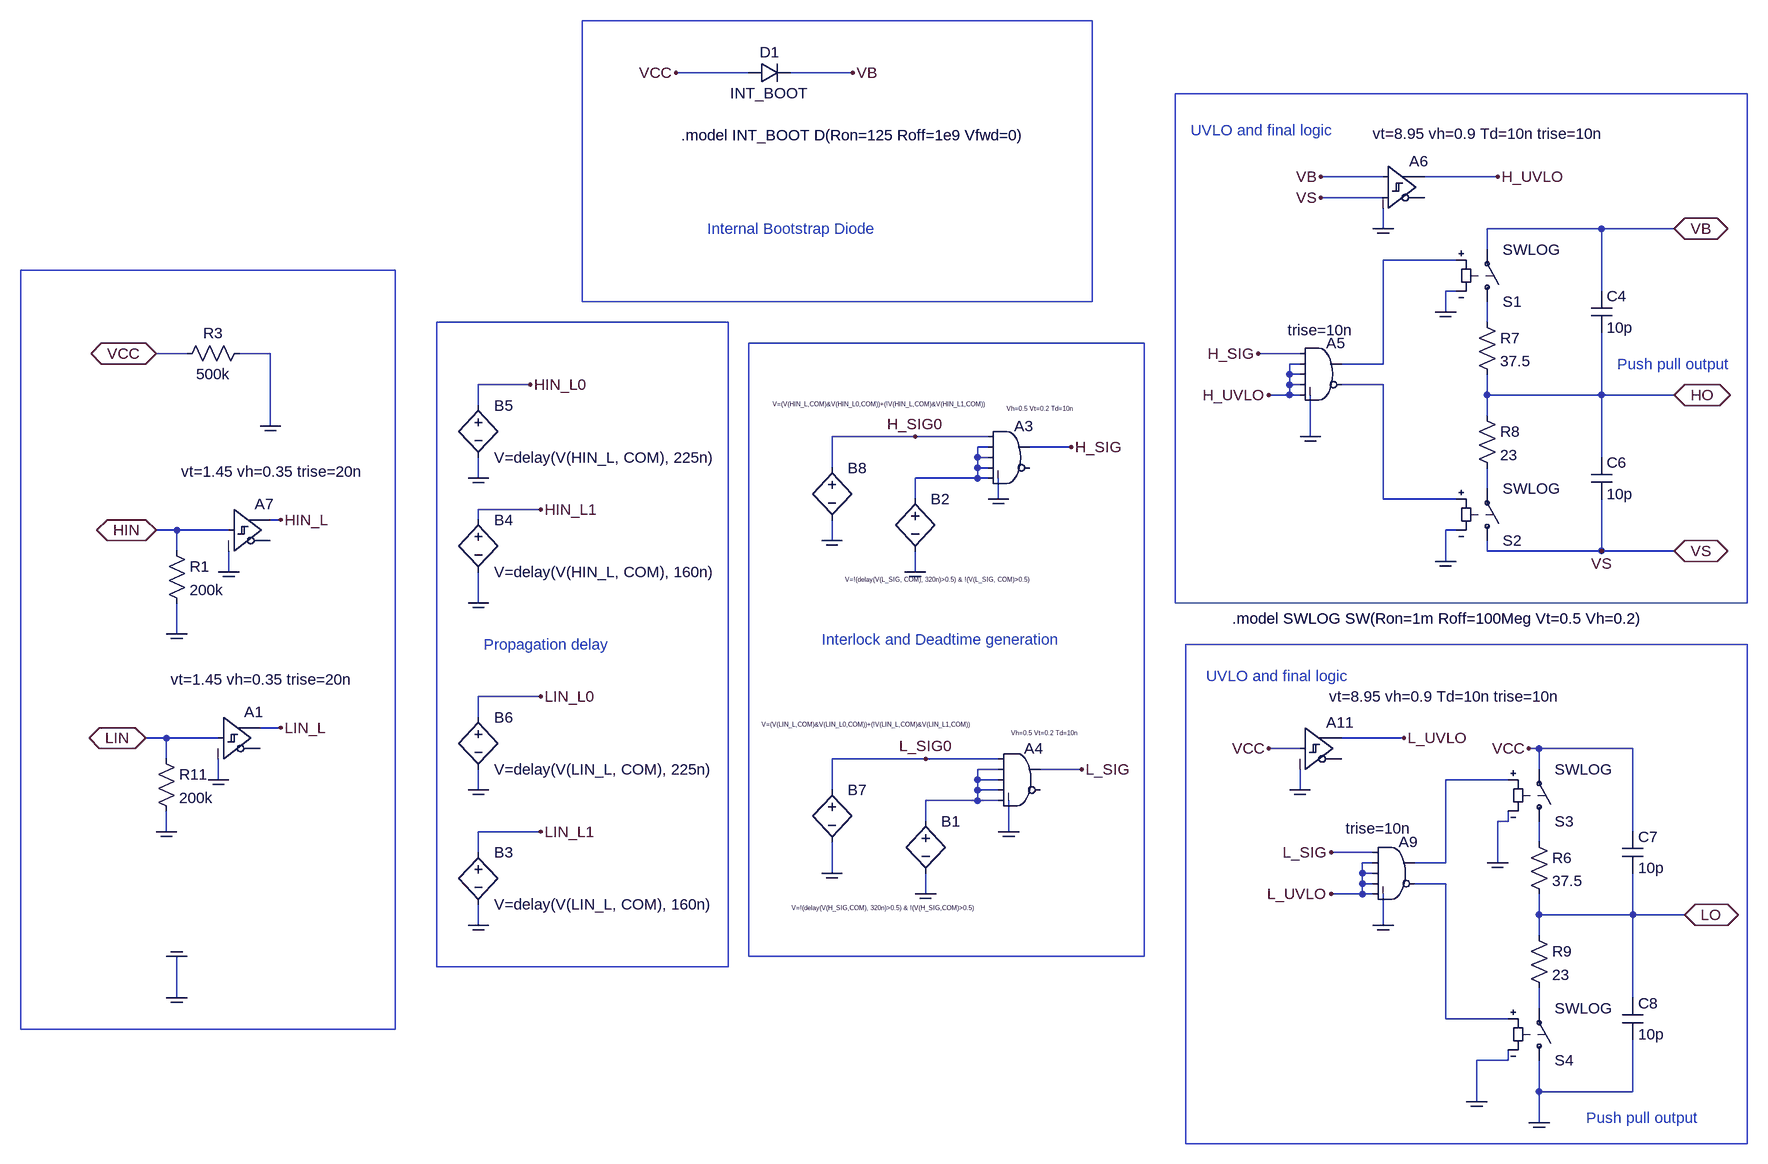
[diagram p0: schematic L6388_Behavioral.asc]
L6388_Behavioral.asc, the LTspice schematic file:
Version 4.1
SHEET 1 2452 1396
WIRE 720 -560 608 -560
WIRE 880 -560 784 -560
WIRE 1696 -400 1600 -400
WIRE 1872 -400 1760 -400
WIRE 1696 -368 1600 -368
WIRE 1696 -320 1696 -352
WIRE 2032 -320 1856 -320
WIRE 2144 -320 2032 -320
WIRE 1856 -288 1856 -320
WIRE 1808 -272 1696 -272
WIRE 1808 -224 1792 -224
WIRE 2032 -224 2032 -320
WIRE 1792 -192 1792 -224
WIRE 1856 -176 1856 -208
WIRE -144 -128 -192 -128
WIRE -16 -128 -64 -128
WIRE 1568 -128 1504 -128
WIRE 1568 -112 1552 -112
WIRE 1696 -112 1696 -272
WIRE 1696 -112 1632 -112
WIRE 1552 -96 1552 -112
WIRE 1568 -96 1552 -96
WIRE 384 -80 304 -80
WIRE 1552 -80 1552 -96
WIRE 1568 -80 1552 -80
WIRE 1696 -80 1632 -80
WIRE 1552 -64 1552 -80
WIRE 1552 -64 1520 -64
WIRE 1568 -64 1552 -64
WIRE 1856 -64 1856 -96
WIRE 2032 -64 2032 -160
WIRE 2032 -64 1856 -64
WIRE 2144 -64 2032 -64
WIRE 304 -48 304 -80
WIRE 1856 -32 1856 -64
WIRE -16 -16 -16 -128
WIRE 976 0 848 0
WIRE 1088 0 976 0
WIRE 1584 0 1584 -64
WIRE 1088 16 1072 16
WIRE 1216 16 1152 16
WIRE 1072 32 1072 16
WIRE 1088 32 1072 32
WIRE 2032 32 2032 -64
WIRE 848 48 848 0
WIRE 1072 48 1072 32
WIRE 1088 48 1072 48
WIRE 304 64 304 32
WIRE 1072 64 1072 48
WIRE 1072 64 976 64
WIRE 1088 64 1072 64
WIRE 1856 80 1856 48
WIRE 976 96 976 64
WIRE 1104 96 1104 64
WIRE 1696 96 1696 -80
WIRE 1808 96 1696 96
WIRE 400 112 304 112
WIRE 0 128 -16 128
WIRE 304 128 304 112
WIRE -160 144 -192 144
WIRE -80 144 -160 144
WIRE 1808 144 1792 144
WIRE 848 160 848 128
WIRE -160 176 -160 144
WIRE 1856 176 1856 160
WIRE 2032 176 2032 96
WIRE 2032 176 1856 176
WIRE 2144 176 2032 176
WIRE 1792 192 1792 144
WIRE -80 208 -80 176
WIRE 976 208 976 176
WIRE 304 256 304 208
WIRE -160 304 -160 256
WIRE 400 400 304 400
WIRE 304 432 304 400
WIRE 0 448 -32 448
WIRE -176 464 -208 464
WIRE -96 464 -176 464
WIRE 1728 464 1632 464
WIRE 1568 480 1520 480
WIRE 1936 480 1920 480
WIRE 2080 480 1936 480
WIRE -176 496 -176 464
WIRE 992 496 848 496
WIRE 1104 496 992 496
WIRE 1104 512 1072 512
WIRE 1232 512 1168 512
WIRE 1936 512 1936 480
WIRE -96 528 -96 496
WIRE 1072 528 1072 512
WIRE 1104 528 1072 528
WIRE 1888 528 1792 528
WIRE 304 544 304 512
WIRE 848 544 848 496
WIRE 1072 544 1072 528
WIRE 1104 544 1072 544
WIRE 1568 544 1568 512
WIRE 1072 560 1072 544
WIRE 1072 560 992 560
WIRE 1104 560 1072 560
WIRE 992 592 992 560
WIRE 1888 592 1888 576
WIRE 1888 592 1872 592
WIRE -176 608 -176 576
WIRE 400 608 304 608
WIRE 1120 608 1120 560
WIRE 2080 608 2080 480
WIRE 1936 624 1936 592
WIRE 304 640 304 608
WIRE 1680 640 1616 640
WIRE 1680 656 1664 656
WIRE 1792 656 1792 528
WIRE 1792 656 1744 656
WIRE 1872 656 1872 592
WIRE 848 672 848 624
WIRE 1664 672 1664 656
WIRE 1680 672 1664 672
WIRE 1664 688 1664 672
WIRE 1680 688 1664 688
WIRE 1792 688 1744 688
WIRE 992 704 992 672
WIRE 1664 704 1664 688
WIRE 1664 704 1616 704
WIRE 1680 704 1664 704
WIRE 1936 736 1936 704
WIRE 2080 736 2080 672
WIRE 2080 736 1936 736
WIRE 2160 736 2080 736
WIRE 304 752 304 720
WIRE 1696 752 1696 704
WIRE 1936 768 1936 736
WIRE -160 864 -160 800
WIRE 2080 864 2080 736
WIRE 1936 880 1936 848
WIRE 1792 896 1792 688
WIRE 1888 896 1792 896
WIRE 1888 960 1888 944
WIRE 1888 960 1840 960
WIRE 1936 1008 1936 960
WIRE 2080 1008 2080 928
WIRE 2080 1008 1936 1008
WIRE 1840 1024 1840 960
WIRE 1936 1056 1936 1008
FLAG -192 144 HIN
IOPIN -192 144 BiDir
FLAG -208 464 LIN
IOPIN -208 464 BiDir
FLAG -160 800 COM
IOPIN -160 800 BiDir
FLAG -192 -128 VCC
IOPIN -192 -128 BiDir
FLAG 2144 -64 HO
IOPIN 2144 -64 BiDir
FLAG 2144 176 VS
IOPIN 2144 176 BiDir
FLAG 2144 -320 VB
IOPIN 2144 -320 BiDir
FLAG -160 864 COM
FLAG -160 304 COM
FLAG 1232 512 L_SIG
FLAG 1216 16 H_SIG
FLAG 2160 736 LO
IOPIN 2160 736 BiDir
FLAG 1936 1056 COM
FLAG 1920 480 VCC
FLAG 1600 -400 VB
FLAG 1696 -320 COM
FLAG 1568 544 COM
FLAG 1520 480 VCC
FLAG 1728 464 L_UVLO
FLAG 1872 -400 H_UVLO
FLAG 1504 -128 H_SIG
FLAG 1520 -64 H_UVLO
FLAG 1616 704 L_UVLO
FLAG 1616 640 L_SIG
FLAG 1120 608 COM
FLAG 1696 752 COM
FLAG 1584 0 COM
FLAG 1104 96 COM
FLAG -16 -16 COM
FLAG 1840 1024 COM
FLAG 1872 656 COM
FLAG 992 704 COM
FLAG 976 208 COM
FLAG 304 752 COM
FLAG 304 256 COM
FLAG 1792 -192 COM
FLAG 1792 192 COM
FLAG 1600 -368 VS
FLAG 2032 176 VS
FLAG -80 208 COM
FLAG -96 528 COM
FLAG 0 128 HIN_L
FLAG 304 64 COM
FLAG 304 544 COM
FLAG 384 -80 HIN_L0
FLAG 400 112 HIN_L1
FLAG 400 400 LIN_L0
FLAG 400 608 LIN_L1
FLAG 848 672 COM
FLAG 848 160 COM
FLAG 976 0 H_SIG0
FLAG 992 496 L_SIG0
FLAG 0 448 LIN_L
FLAG -176 608 COM
FLAG 608 -560 VCC
FLAG 880 -560 VB
SYMBOL res -176 160 R0
SYMATTR InstName R1
SYMATTR Value 200k
SYMBOL res -48 -144 R90
WINDOW 0 0 56 VBottom 2
WINDOW 3 32 56 VTop 2
SYMATTR InstName R3
SYMATTR Value 500k
SYMBOL Digital\\and 1120 -32 R0
WINDOW 39 -3 -11 Left 0
SYMATTR SpiceLine Vh=0.5 Vt=0.2 Td=10n
SYMATTR InstName A3
SYMBOL Digital\\and 1136 464 R0
WINDOW 39 -12 -8 Left 0
SYMATTR SpiceLine Vh=0.5 Vt=0.2 Td=10n
SYMATTR InstName A4
SYMBOL sw 1856 -192 M180
SYMATTR InstName S1
SYMATTR Value SWLOG
SYMBOL sw 1856 176 M180
SYMATTR InstName S2
SYMATTR Value SWLOG
SYMBOL res 1840 -192 R0
SYMATTR InstName R7
SYMATTR Value 37.5
SYMBOL res 1840 -48 R0
SYMATTR InstName R8
SYMATTR Value 23
SYMBOL sw 1936 608 M180
SYMATTR InstName S3
SYMATTR Value SWLOG
SYMBOL sw 1936 976 M180
SYMATTR InstName S4
SYMATTR Value SWLOG
SYMBOL res 1920 608 R0
SYMATTR InstName R6
SYMATTR Value 37.5
SYMBOL res 1920 752 R0
SYMATTR InstName R9
SYMATTR Value 23
SYMBOL Digital\\and 1600 -160 R0
WINDOW 39 -51 -4 Left 2
SYMATTR SpiceLine trise=10n
SYMATTR InstName A5
SYMBOL Digital\\and 1712 608 R0
WINDOW 39 -74 -5 Left 2
SYMATTR SpiceLine trise=10n
SYMATTR InstName A9
SYMBOL bv 992 576 R0
WINDOW 3 -206 149 Left 0
SYMATTR Value V=!(delay(V(H_SIG,COM), 320n)>0.5) & !(V(H_SIG,COM)>0.5)
SYMATTR InstName B1
SYMBOL bv 976 80 R0
WINDOW 3 -108 140 Left 0
SYMATTR Value V=!(delay(V(L_SIG, COM), 320n)>0.5) & !(V(L_SIG, COM)>0.5)
SYMATTR InstName B2
SYMBOL bv 304 624 R0
SYMATTR InstName B3
SYMATTR Value V=delay(V(LIN_L, COM), 160n)
SYMBOL bv 304 112 R0
SYMATTR InstName B4
SYMATTR Value V=delay(V(HIN_L, COM), 160n)
SYMBOL Digital\\schmitt 1568 416 R0
WINDOW 39 45 -16 Left 2
SYMATTR SpiceLine vt=8.95 vh=0.9 Td=10n trise=10n
SYMATTR InstName A11
SYMBOL Digital\\diffschmitt 1696 -448 R0
WINDOW 39 -16 -18 Left 2
SYMATTR SpiceLine vt=8.95 vh=0.9 Td=10n trise=10n
SYMATTR InstName A6
SYMBOL Digital\\schmitt -80 80 R0
WINDOW 39 -73 -26 Left 2
SYMATTR SpiceLine vt=1.45 vh=0.35 trise=20n
SYMATTR InstName A7
SYMBOL Digital\\schmitt -96 400 R0
WINDOW 39 -73 -26 Left 2
SYMATTR SpiceLine vt=1.45 vh=0.35 trise=20n
SYMATTR InstName A1
SYMBOL bv 304 -64 R0
SYMATTR InstName B5
SYMATTR Value V=delay(V(HIN_L, COM), 225n)
SYMBOL bv 304 416 R0
SYMATTR InstName B6
SYMATTR Value V=delay(V(LIN_L, COM), 225n)
SYMBOL bv 848 528 R0
WINDOW 3 -108 -85 Left 0
SYMATTR Value V=(V(LIN_L,COM)&V(LIN_L0,COM))+(!V(LIN_L,COM)&V(LIN_L1,COM))
SYMATTR InstName B7
SYMBOL bv 848 32 R0
WINDOW 3 -91 -82 Left 0
SYMATTR Value V=(V(HIN_L,COM)&V(HIN_L0,COM))+(!V(HIN_L,COM)&V(HIN_L1,COM))
SYMATTR InstName B8
SYMBOL res -192 480 R0
SYMATTR InstName R11
SYMATTR Value 200k
SYMBOL cap 2016 -224 R0
SYMATTR InstName C4
SYMATTR Value 10p
SYMBOL cap 2016 32 R0
SYMATTR InstName C6
SYMATTR Value 10p
SYMBOL cap 2064 608 R0
SYMATTR InstName C7
SYMATTR Value 10p
SYMBOL cap 2064 864 R0
SYMATTR InstName C8
SYMATTR Value 10p
SYMBOL diode 720 -544 R270
WINDOW 0 32 32 VTop 2
WINDOW 3 0 32 VBottom 2
SYMATTR InstName D1
SYMATTR Value INT_BOOT
TEXT 1464 280 Left 2 !.model SWLOG SW(Ron=1m Roff=100Meg Vt=0.5 Vh=0.2)
TEXT 312 320 Left 2 ;Propagation delay
TEXT 832 312 Left 2 ;Interlock and Deadtime generation
TEXT 1400 -472 Left 2 ;UVLO and final logic
TEXT 1424 368 Left 2 ;UVLO and final logic
TEXT 2008 1048 Left 2 ;Push pull output
TEXT 2056 -112 Left 2 ;Push pull output
TEXT 616 -464 Left 2 !.model INT_BOOT D(Ron=125 Roff=1e9 Vfwd=0)
TEXT 656 -320 Left 2 ;Internal Bootstrap Diode
RECTANGLE Normal 688 816 240 -176
RECTANGLE Normal 1328 800 720 -144
RECTANGLE Normal 2256 1088 1392 320
RECTANGLE Normal 2256 256 1376 -528
RECTANGLE Normal 176 912 -400 -256
RECTANGLE Normal 1248 -208 464 -640

The netlist it stands for:
* L6388_Behavioral.asc
R1 HIN COM 200k
R3 COM VCC 500k
A3 H_SIG0 N004 N004 N004 N004 COM H_SIG COM AND Vh=0.5 Vt=0.2 Td=10n
A4 L_SIG0 N006 N006 N006 N006 COM L_SIG COM AND Vh=0.5 Vt=0.2 Td=10n
S1 N002 VB N001 COM SWLOG
S2 VS N005 N003 COM SWLOG
R7 N002 HO 37.5
R8 HO N005 23
S3 N008 VCC N007 COM SWLOG
S4 COM N010 N009 COM SWLOG
R6 N008 LO 37.5
R9 LO N010 23
A5 H_SIG H_UVLO H_UVLO H_UVLO H_UVLO N003 N001 COM AND trise=10n
A9 L_SIG L_UVLO L_UVLO L_UVLO L_UVLO N009 N007 COM AND trise=10n
B1 N006 COM V=!(delay(V(H_SIG,COM), 320n)>0.5) & !(V(H_SIG,COM)>0.5)
B2 N004 COM V=!(delay(V(L_SIG, COM), 320n)>0.5) & !(V(L_SIG, COM)>0.5)
B3 LIN_L1 COM V=delay(V(LIN_L, COM), 160n)
B4 HIN_L1 COM V=delay(V(HIN_L, COM), 160n)
A11 VCC COM COM COM COM COM L_UVLO COM SCHMITT vt=8.95 vh=0.9 Td=10n trise=10n
A6 VB VS COM COM COM COM H_UVLO COM SCHMITT vt=8.95 vh=0.9 Td=10n trise=10n
A7 HIN COM COM COM COM COM HIN_L COM SCHMITT vt=1.45 vh=0.35 trise=20n
A1 LIN COM COM COM COM COM LIN_L COM SCHMITT vt=1.45 vh=0.35 trise=20n
B5 HIN_L0 COM V=delay(V(HIN_L, COM), 225n)
B6 LIN_L0 COM V=delay(V(LIN_L, COM), 225n)
B7 L_SIG0 COM V=(V(LIN_L,COM)&V(LIN_L0,COM))+(!V(LIN_L,COM)&V(LIN_L1,COM))
B8 H_SIG0 COM V=(V(HIN_L,COM)&V(HIN_L0,COM))+(!V(HIN_L,COM)&V(HIN_L1,COM))
R11 LIN COM 200k
C4 VB HO 10p
C6 HO VS 10p
C7 VCC LO 10p
C8 LO COM 10p
D1 VCC VB INT_BOOT
.model D D
.lib standard.dio
.model SWLOG SW(Ron=1m Roff=100Meg Vt=0.5 Vh=0.2)
* Propagation delay
* Interlock and Deadtime generation
* UVLO and final logic
* UVLO and final logic
* Push pull output
* Push pull output
.model INT_BOOT D(Ron=125 Roff=1e9 Vfwd=0)
* Internal Bootstrap Diode
.backanno
.end